# EAGLE design Hi-Hat2 (EAGLE 8.6.2)
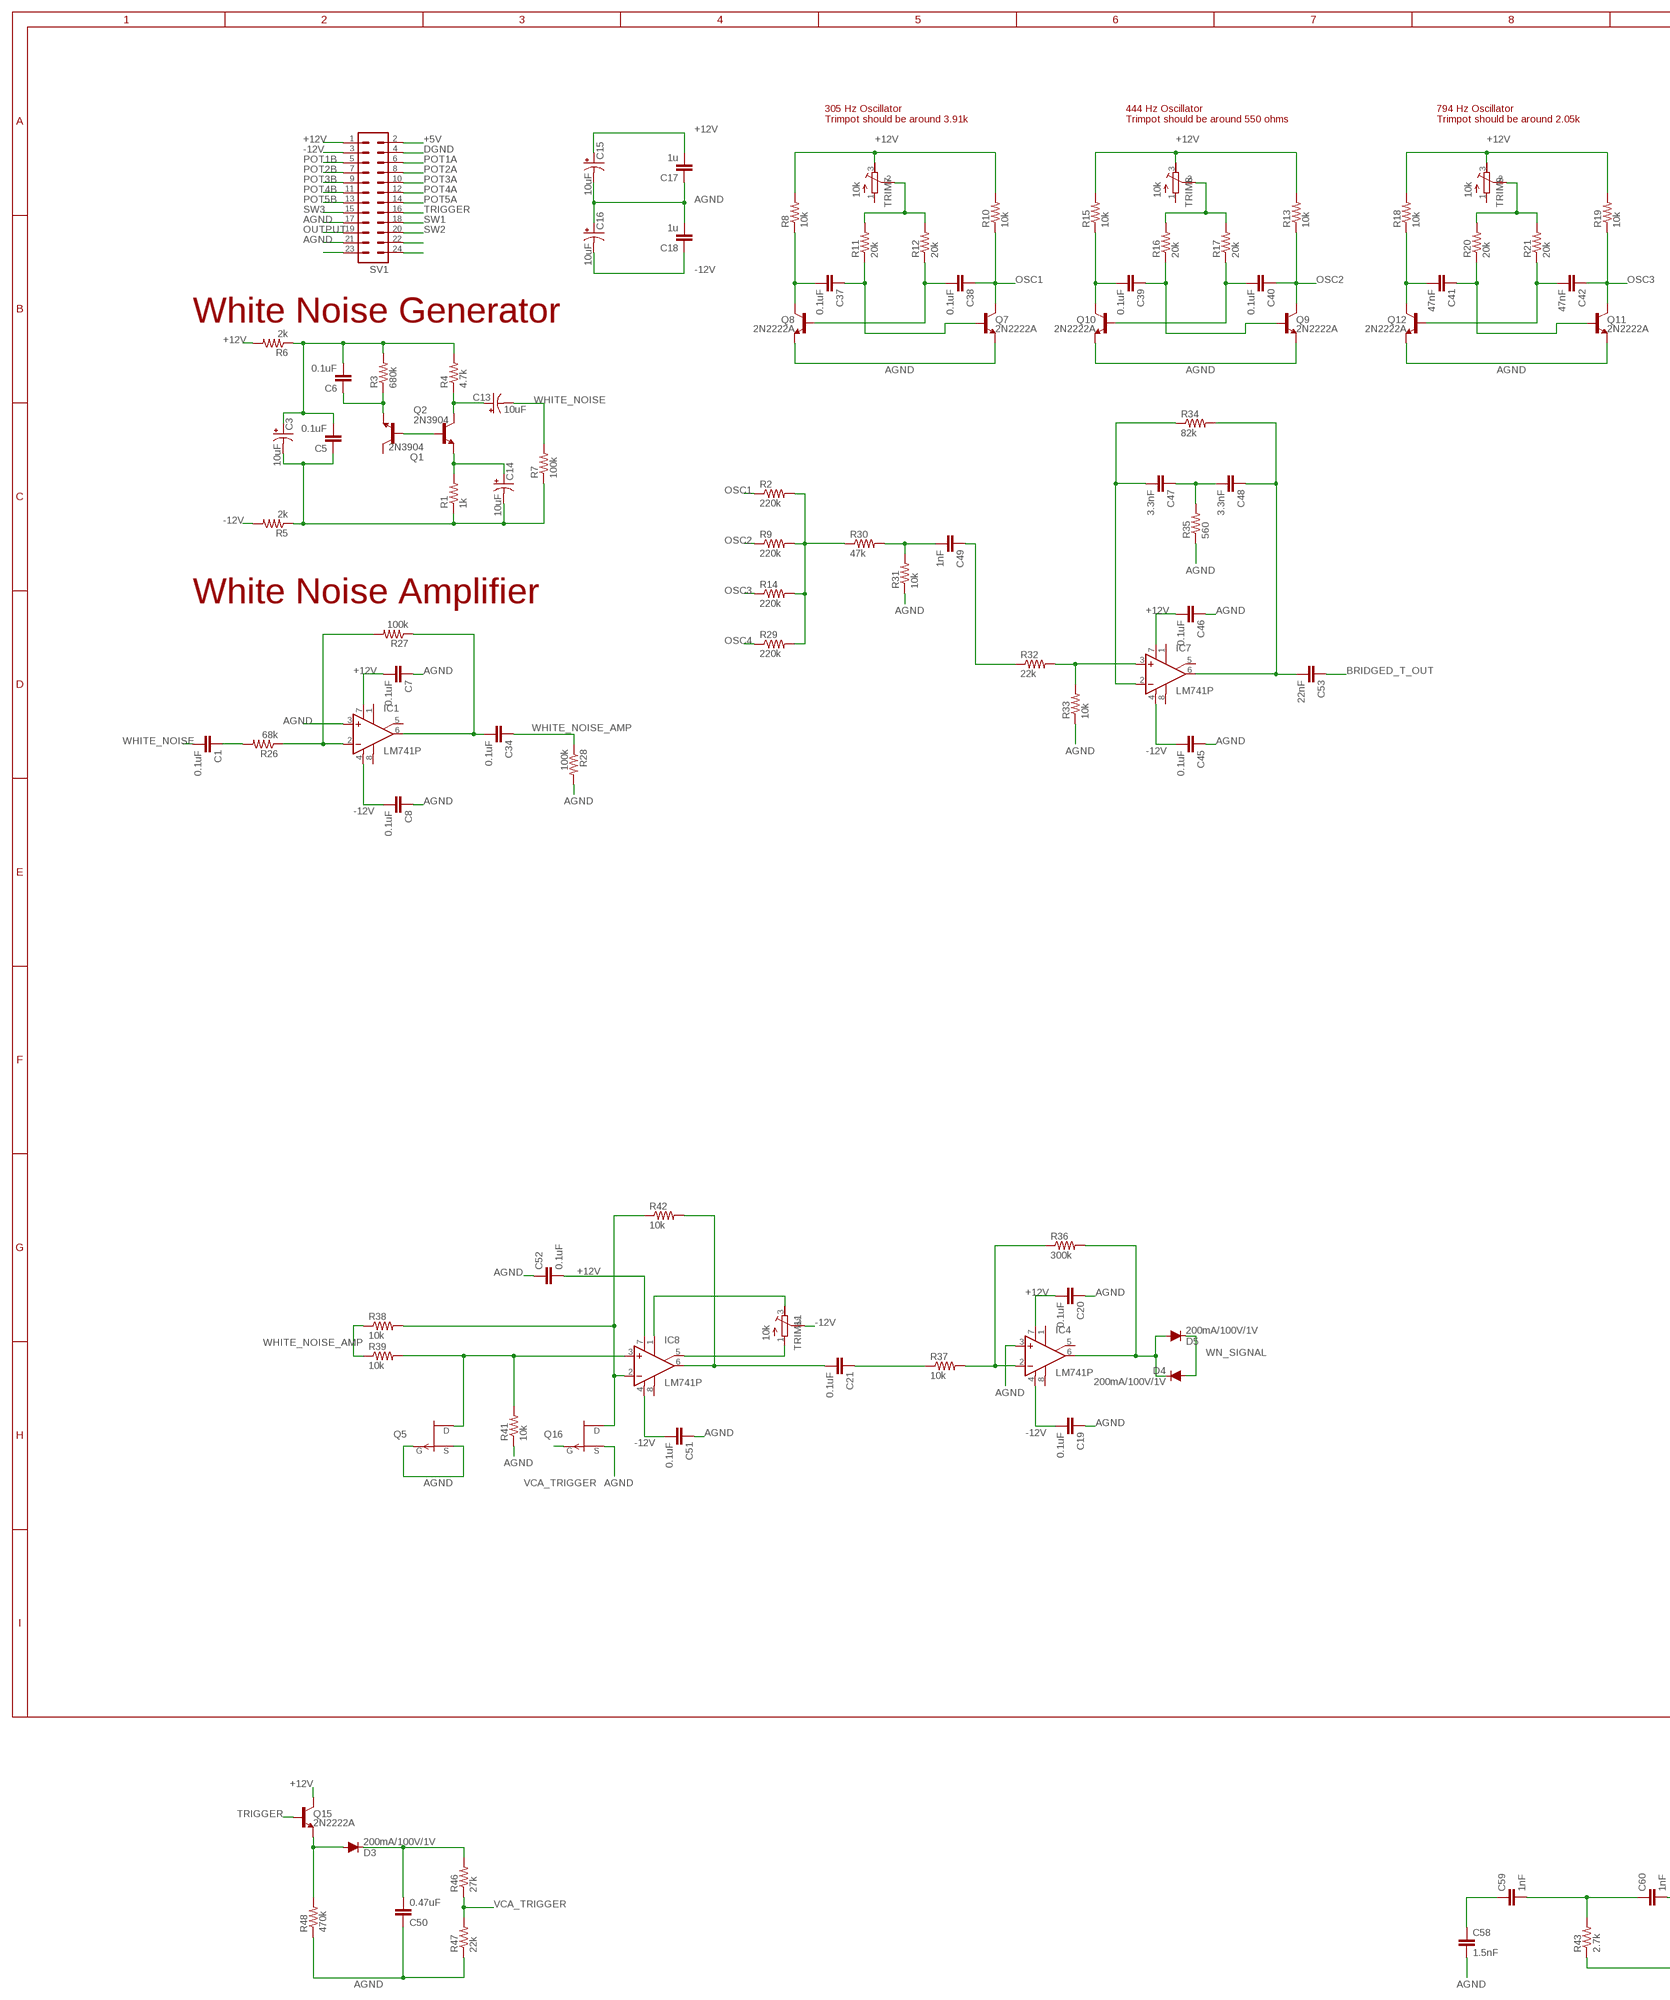
[diagram p0: schematic, sheet 1, part 1 of 2]
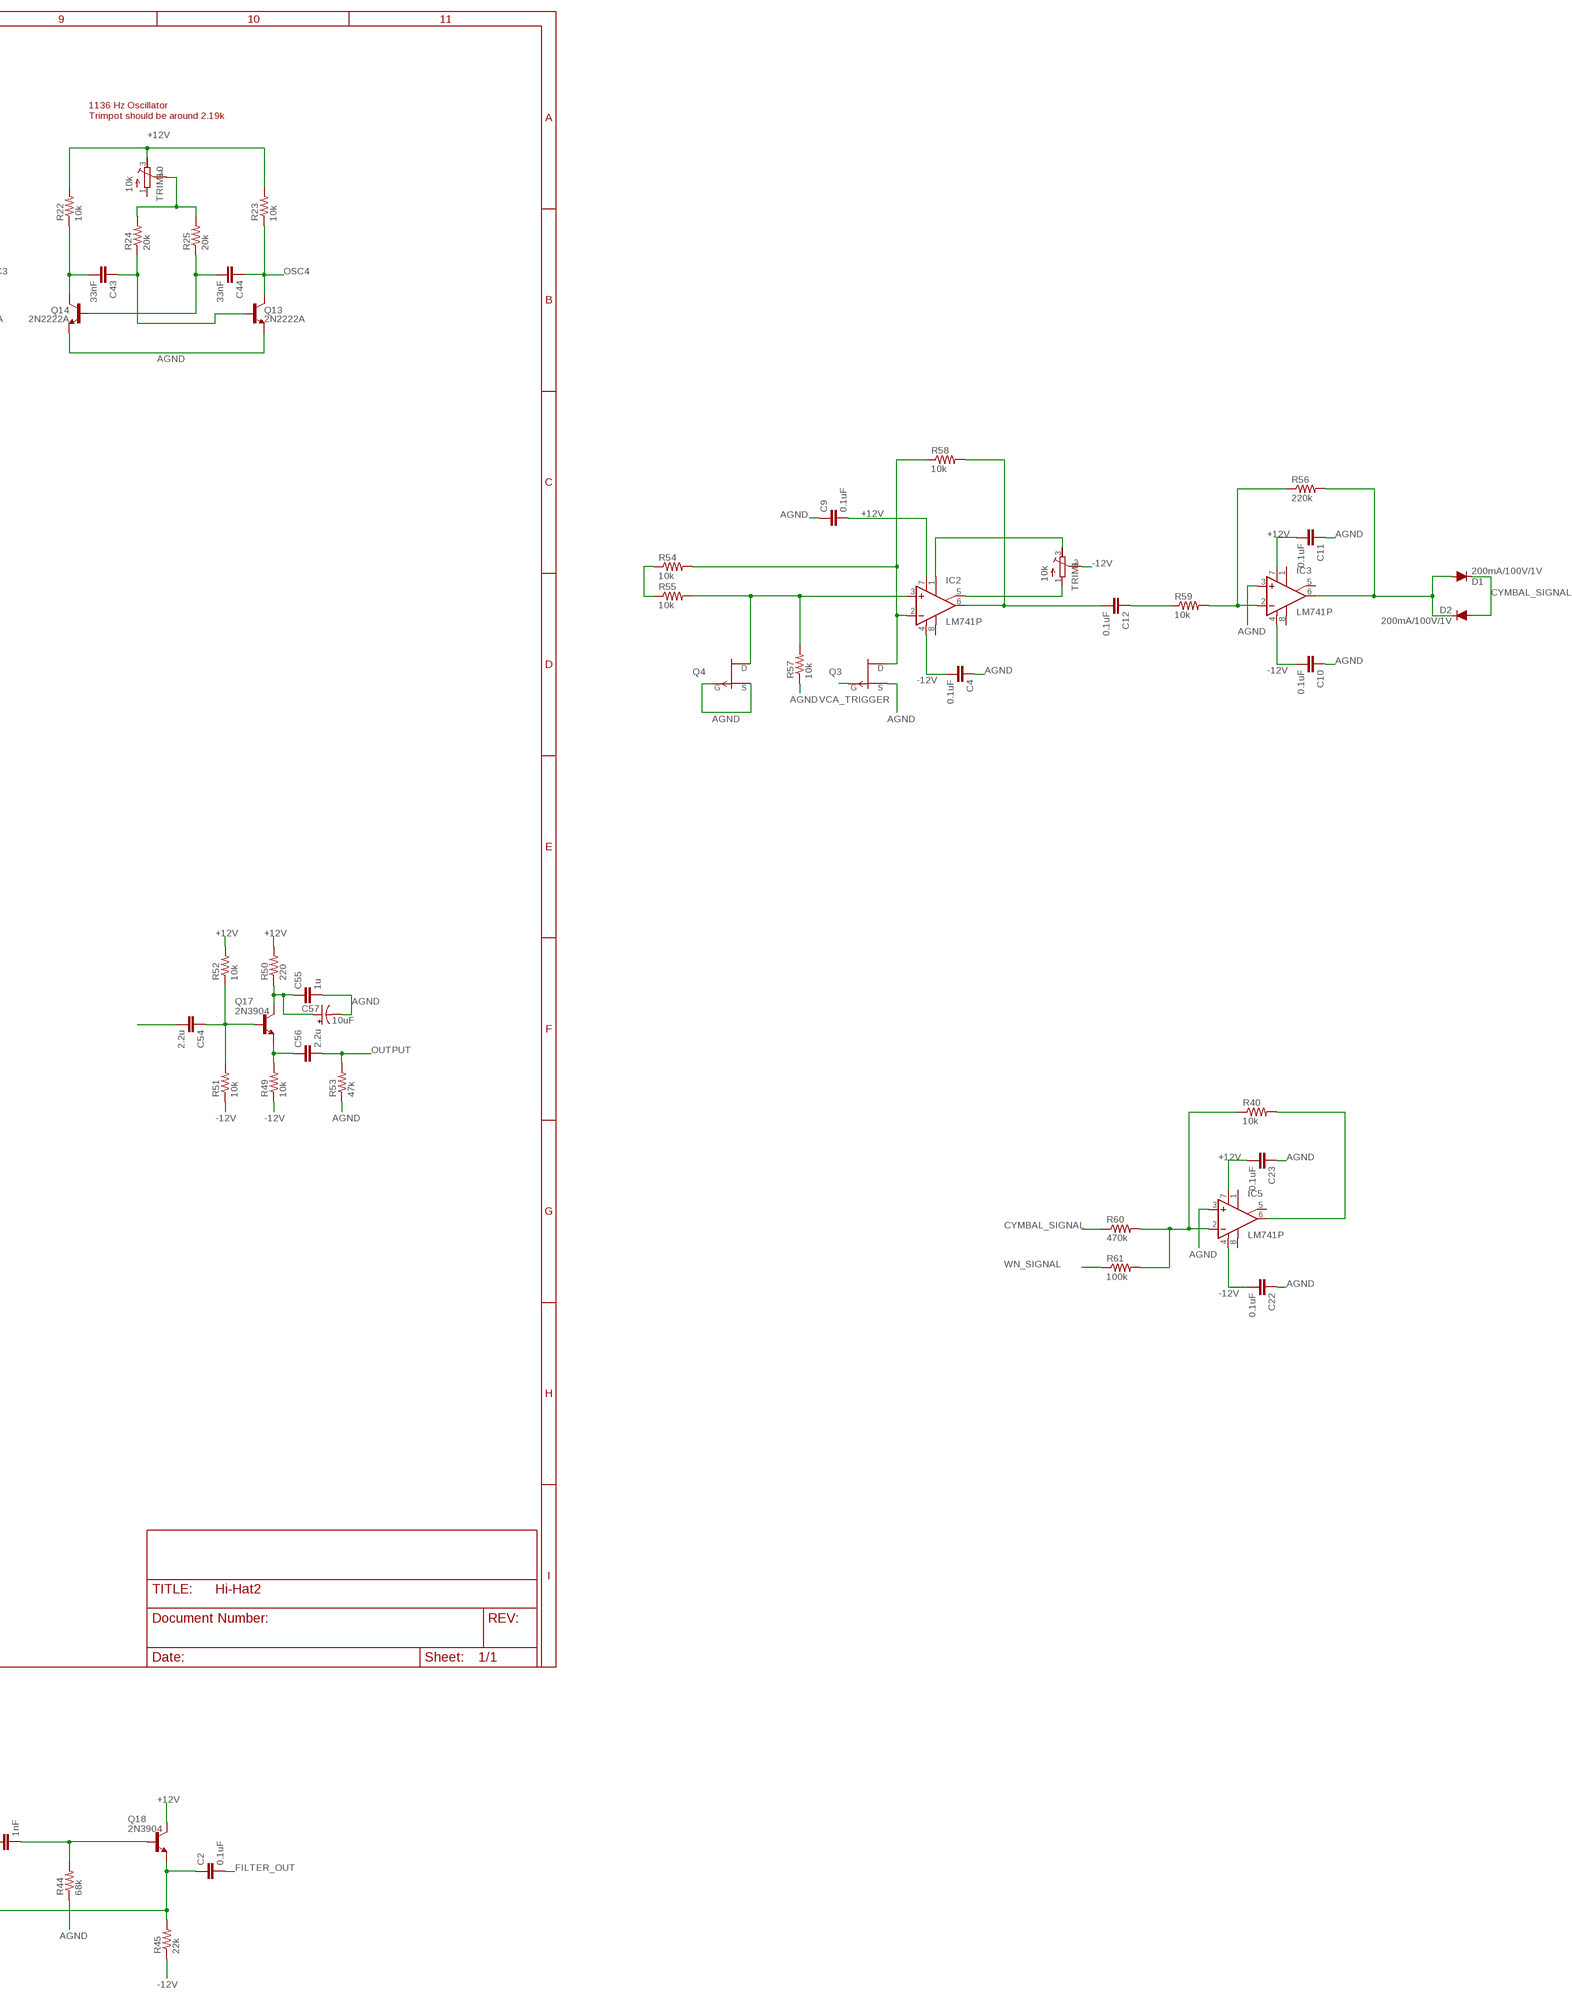
[diagram p1: schematic, sheet 1, part 2 of 2]

## Parts
C1  0.1uF  C-EU050-024X044  [C050-024X044]
C2  0.1uF  C-EU050-024X044  [C050-024X044]
C3  10uF  CPOL-USE2.5-6  [E2,5-6]
C4  0.1uF  C-EU050-024X044  [C050-024X044]
C5  0.1uF  C-EU050-024X044  [C050-024X044]
C6  0.1uF  C-EU050-024X044  [C050-024X044]
C7  0.1uF  C-EU050-024X044  [C050-024X044]
C8  0.1uF  C-EU050-024X044  [C050-024X044]
C9  0.1uF  C-EU050-024X044  [C050-024X044]
C10  0.1uF  C-EU050-024X044  [C050-024X044]
C11  0.1uF  C-EU050-024X044  [C050-024X044]
C12  0.1uF  C-EU050-024X044  [C050-024X044]
C13  10uF  CPOL-USE2.5-6  [E2,5-6]
C14  10uF  CPOL-USE2.5-6  [E2,5-6]
C15  10uF  CPOL-USE2.5-6  [E2,5-6]
C16  10uF  CPOL-USE2.5-6  [E2,5-6]
C17  1u  C-EU050-024X044  [C050-024X044]
C18  1u  C-EU050-024X044  [C050-024X044]
C19  0.1uF  C-EU050-024X044  [C050-024X044]
C20  0.1uF  C-EU050-024X044  [C050-024X044]
C21  0.1uF  C-EU050-024X044  [C050-024X044]
C22  0.1uF  C-EU050-024X044  [C050-024X044]
C23  0.1uF  C-EU050-024X044  [C050-024X044]
C34  0.1uF  C-EU050-024X044  [C050-024X044]
C37  0.1uF  C-EU050-024X044  [C050-024X044]
C38  0.1uF  C-EU050-024X044  [C050-024X044]
C39  0.1uF  C-EU050-024X044  [C050-024X044]
C40  0.1uF  C-EU050-024X044  [C050-024X044]
C41  47nF  C-EU050-024X044  [C050-024X044]
C42  47nF  C-EU050-024X044  [C050-024X044]
C43  33nF  C-EU050-024X044  [C050-024X044]
C44  33nF  C-EU050-024X044  [C050-024X044]
C45  0.1uF  C-EU050-024X044  [C050-024X044]
C46  0.1uF  C-EU050-024X044  [C050-024X044]
C47  3.3nF  C-EU050-024X044  [C050-024X044]
C48  3.3nF  C-EU050-024X044  [C050-024X044]
C49  1nF  C-EU050-024X044  [C050-024X044]
C50  0.47uF  C-EU050-024X044  [C050-024X044]
C51  0.1uF  C-EU050-024X044  [C050-024X044]
C52  0.1uF  C-EU050-024X044  [C050-024X044]
C53  22nF  C-EU050-024X044  [C050-024X044]
C54  2.2u  C-EU050-024X044  [C050-024X044]
C55  1u  C-EU050-024X044  [C050-024X044]
C56  2.2u  C-EU050-024X044  [C050-024X044]
C57  10uF  CPOL-USE2.5-6  [E2,5-6]
C58  1.5nF  C-EU050-024X044  [C050-024X044]
C59  1nF  C-EU050-024X044  [C050-024X044]
C60  1nF  C-EU050-024X044  [C050-024X044]
D1  200mA/100V/1V  DIODE-1N4148  [DIODE-1N4148]
D2  200mA/100V/1V  DIODE-1N4148  [DIODE-1N4148]
D3  200mA/100V/1V  DIODE-1N4148  [DIODE-1N4148]
D4  200mA/100V/1V  DIODE-1N4148  [DIODE-1N4148]
D5  200mA/100V/1V  DIODE-1N4148  [DIODE-1N4148]
IC1  LM741P  [DIL08]
IC2  LM741P  [DIL08]
IC3  LM741P  [DIL08]
IC4  LM741P  [DIL08]
IC5  LM741P  [DIL08]
IC7  LM741P  [DIL08]
IC8  LM741P  [DIL08]
Q1  2N3904  [TO92]
Q2  2N3904  [TO92]
Q3  J176  [TO-92]
Q4  J176  [TO-92]
Q5  J176  [TO-92]
Q7  2N2222A  TRANS_NPN-P2N2222A  [TO-92]
Q8  2N2222A  TRANS_NPN-P2N2222A  [TO-92]
Q9  2N2222A  TRANS_NPN-P2N2222A  [TO-92]
Q10  2N2222A  TRANS_NPN-P2N2222A  [TO-92]
Q11  2N2222A  TRANS_NPN-P2N2222A  [TO-92]
Q12  2N2222A  TRANS_NPN-P2N2222A  [TO-92]
Q13  2N2222A  TRANS_NPN-P2N2222A  [TO-92]
Q14  2N2222A  TRANS_NPN-P2N2222A  [TO-92]
Q15  2N2222A  TRANS_NPN-P2N2222A  [TO-92]
Q16  J176  [TO-92]
Q17  2N3904  [TO92]
Q18  2N3904  [TO92]
R1  1k  R-US_0207/7  [0207/7]
R2  220k  R-US_0207/7  [0207/7]
R3  680k  R-US_0207/7  [0207/7]
R4  4.7k  R-US_0207/7  [0207/7]
R5  2k  R-US_0207/7  [0207/7]
R6  2k  R-US_0207/7  [0207/7]
R7  100k  R-US_0207/7  [0207/7]
R8  10k  R-US_0207/7  [0207/7]
R9  220k  R-US_0207/7  [0207/7]
R10  10k  R-US_0207/7  [0207/7]
R11  20k  R-US_0207/7  [0207/7]
R12  20k  R-US_0207/7  [0207/7]
R13  10k  R-US_0207/7  [0207/7]
R14  220k  R-US_0207/7  [0207/7]
R15  10k  R-US_0207/7  [0207/7]
R16  20k  R-US_0207/7  [0207/7]
R17  20k  R-US_0207/7  [0207/7]
R18  10k  R-US_0207/7  [0207/7]
R19  10k  R-US_0207/7  [0207/7]
R20  20k  R-US_0207/7  [0207/7]
R21  20k  R-US_0207/7  [0207/7]
R22  10k  R-US_0207/7  [0207/7]
R23  10k  R-US_0207/7  [0207/7]
R24  20k  R-US_0207/7  [0207/7]
R25  20k  R-US_0207/7  [0207/7]
R26  68k  R-US_0207/7  [0207/7]
R27  100k  R-US_0207/7  [0207/7]
R28  100k  R-US_0207/7  [0207/7]
R29  220k  R-US_0207/7  [0207/7]
R30  47k  R-US_0207/7  [0207/7]
R31  10k  R-US_0207/7  [0207/7]
R32  22k  R-US_0207/7  [0207/7]
R33  10k  R-US_0207/7  [0207/7]
R34  82k  R-US_0207/7  [0207/7]
R35  560  R-US_0207/7  [0207/7]
R36  300k  R-US_0207/7  [0207/7]
R37  10k  R-US_0207/7  [0207/7]
R38  10k  R-US_0207/7  [0207/7]
R39  10k  R-US_0207/7  [0207/7]
R40  10k  R-US_0207/7  [0207/7]
R41  10k  R-US_0207/7  [0207/7]
R42  10k  R-US_0207/7  [0207/7]
R43  2.7k  R-US_0207/7  [0207/7]
R44  68k  R-US_0207/7  [0207/7]
R45  22k  R-US_0207/7  [0207/7]
R46  27k  R-US_0207/7  [0207/7]
R47  22k  R-US_0207/7  [0207/7]
R48  470k  R-US_0207/7  [0207/7]
R49  10k  R-US_0207/7  [0207/7]
R50  220  R-US_0207/7  [0207/7]
R51  10k  R-US_0207/7  [0207/7]
R52  10k  R-US_0207/7  [0207/7]
R53  47k  R-US_0207/7  [0207/7]
R54  10k  R-US_0207/7  [0207/7]
R55  10k  R-US_0207/7  [0207/7]
R56  220k  R-US_0207/7  [0207/7]
R57  10k  R-US_0207/7  [0207/7]
R58  10k  R-US_0207/7  [0207/7]
R59  10k  R-US_0207/7  [0207/7]
R60  470k  R-US_0207/7  [0207/7]
R61  100k  R-US_0207/7  [0207/7]
SV1  MA12-2  [MA12-2]
TRIM1  10k  R-TRIMM64W  [RTRIM64W]
TRIM7  10k  R-TRIMM64W  [RTRIM64W]
TRIM8  10k  R-TRIMM64W  [RTRIM64W]
TRIM9  10k  R-TRIMM64W  [RTRIM64W]
TRIM10  10k  R-TRIMM64W  [RTRIM64W]
TRIM11  10k  R-TRIMM64W  [RTRIM64W]

## Nets
+5V: SV1.2
+12V: C7.2 C9.2 C11.2 C15.+ C17.2 C20.2 C23.2 C46.2 C52.2 IC1.7(V+) IC2.7(V+) IC3.7(V+) IC4.7(V+) IC5.7(V+) IC7.7(V+) IC8.7(V+) Q15.1(C) Q18.1(C) R6.2 R8.2 R10.2 R13.2 R15.2 R18.2 R19.2 R22.2 R23.2 R50.2 R52.2 SV1.1 TRIM7.3(E) TRIM8.3(E) TRIM9.3(E) TRIM10.3(E)
-12V: C4.2 C8.2 C10.2 C16.- C18.1 C19.2 C22.2 C45.2 C51.2 IC1.4(V-) IC2.4(V-) IC3.4(V-) IC4.4(V-) IC5.4(V-) IC7.4(V-) IC8.4(V-) R5.2 R45.1 R49.1 R51.1 SV1.3 TRIM1.2(S) TRIM11.2(S)
AGND: C4.1 C7.1 C8.1 C9.1 C10.1 C11.1 C15.- C16.+ C17.1 C18.2 C19.1 C20.1 C22.1 C23.1 C45.1 C46.1 C50.1 C51.1 C52.1 C55.2 C57.- C58.2 IC1.3(+IN) IC3.3(+IN) IC4.3(+IN) IC5.3(+IN) Q3.3(S) Q4.2(G) Q4.3(S) Q5.2(G) Q5.3(S) Q7.3(E) Q8.3(E) Q9.3(E) Q10.3(E) Q11.3(E) Q12.3(E) Q13.3(E) Q14.3(E) Q16.3(S) R28.2 R31.1 R33.1 R35.1 R41.1 R44.1 R47.1 R48.1 R53.1 R57.1 SV1.17 SV1.21
BRIDGED_T_OUT: C53.1
CC_INPUT1: C54.2
CYMBAL_SIGNAL: D1.C D2.A R60.1
DGND: SV1.4
FILTER_OUT: C2.2
N$1: C50.2 D3.C R46.2
N$2: IC2.3(+IN) Q4.1(D) R55.2 R57.2
N$3: IC2.2(-IN) Q3.1(D) R54.2 R58.1
N$4: IC2.5(ON2) TRIM1.1(A)
N$5: C14.+ Q2.3(E) R1.2
N$6: C3.+ C5.2 C6.2 R3.2 R4.2 R6.1
N$7: IC2.1(ON1) TRIM1.3(E)
N$8: IC3.2(-IN) R56.1 R59.2
N$9: C34.2 IC1.6(OUT) R27.1
N$10: IC5.2(-IN) R40.1 R60.2 R61.2
N$11: C37.2 Q8.1(C) R8.1
N$12: C37.1 Q7.2(B) R11.1
N$13: C38.2 Q8.2(B) R12.1
N$14: C47.2 IC7.2(-IN) R34.1
N$15: R11.2 R12.2 TRIM7.2(S)
N$16: C39.2 Q10.1(C) R15.1
N$17: Q1.2(B) Q2.2(B)
N$18: C39.1 Q9.2(B) R16.1
N$19: C40.2 Q10.2(B) R17.1
N$20: C6.1 Q1.3(E) R3.1
N$21: C3.- C5.1 C14.- R1.1 R5.1 R7.1
N$22: R2.2 R9.2 R14.2 R29.2 R30.1
N$23: IC1.2(-IN) R26.1 R27.2
N$24: SV1.23
N$25: SV1.24
N$26: SV1.22
N$27: C12.1 R59.1
N$28: C1.1 R26.2
N$29: R16.2 R17.2 TRIM8.2(S)
N$30: C13.+ Q2.1(C) R4.1
N$31: C41.2 Q12.1(C) R18.1
N$32: IC4.2(-IN) R36.1 R37.2
N$34: C21.1 R37.1
N$35: C41.1 Q11.2(B) R20.1
N$36: C21.2 IC8.6(OUT) R42.2
N$37: IC5.6(OUT) R40.2
N$38: D4.C D5.A IC4.6(OUT) R36.2
N$39: D1.A D2.C IC3.6(OUT) R56.2
N$44: C42.2 Q12.2(B) R21.1
N$47: C47.1 C48.2 R35.2
N$54: R20.2 R21.2 TRIM9.2(S)
N$55: C43.2 Q14.1(C) R22.1
N$56: C43.1 Q13.2(B) R24.1
N$57: C44.2 Q14.2(B) R25.1
N$58: C49.2 R30.2 R31.2
N$59: R24.2 R25.2 TRIM10.2(S)
N$60: C48.1 C53.2 IC7.6(OUT) R34.2
N$61: IC7.3(+IN) R32.2 R33.2
N$62: C49.1 R32.1
N$63: C54.1 Q17.2(B) R51.2 R52.1
N$64: D3.A Q15.3(E) R48.2
N$65: IC8.3(+IN) Q5.1(D) R39.2 R41.2
N$66: IC8.2(-IN) Q16.1(D) R38.2 R42.1
N$67: IC8.5(ON2) TRIM11.1(A)
N$68: IC8.1(ON1) TRIM11.3(E)
N$71: C56.1 Q17.3(E) R49.2
N$72: C55.1 C57.+ Q17.1(C) R50.1
N$73: C59.2 C60.1 R43.2
N$74: C60.2 Q18.2(B) R44.2
N$75: C2.1 Q18.3(E) R43.1 R45.2
OSC1: C38.1 Q7.1(C) R2.1 R10.1
OSC2: C40.1 Q9.1(C) R9.1 R13.1
OSC3: C42.1 Q11.1(C) R14.1 R19.1
OSC4: C44.1 Q13.1(C) R23.1 R29.1
OUTPUT: C56.2 R53.2 SV1.19
POT1A: SV1.6
POT1B: SV1.5
POT2A: SV1.8
POT2B: SV1.7
POT3A: SV1.10
POT3B: SV1.9
POT4A: SV1.12
POT4B: SV1.11
POT5A: SV1.14
POT5B: SV1.13
SW1: C58.1 C59.1 SV1.18
SW2: SV1.20
SW3: SV1.15
SW4: C12.2 IC2.6(OUT) R58.2
TRIGGER: Q15.2(B) SV1.16
VCA_INPUT1: R54.1 R55.1
VCA_TRIGGER: Q3.2(G) Q16.2(G) R46.1 R47.2
WHITE_NOISE: C1.2 C13.- R7.2
WHITE_NOISE_AMP: C34.1 R28.1 R38.1 R39.1
WN_SIGNAL: D4.A D5.C R61.1
Unconnected: IC1.1(ON1) IC1.5(ON2) IC1.8(OPT) IC2.8(OPT) IC3.1(ON1) IC3.5(ON2) IC3.8(OPT) IC4.1(ON1) IC4.5(ON2) IC4.8(OPT) IC5.1(ON1) IC5.5(ON2) IC5.8(OPT) IC7.1(ON1) IC7.5(ON2) IC7.8(OPT) IC8.8(OPT) Q1.1(C) TRIM7.1(A) TRIM8.1(A) TRIM9.1(A) TRIM10.1(A)

## Notes on the sheet
- 305 Hz Oscillator
  Trimpot should be around 3.91k
- 444 Hz Oscillator
  Trimpot should be around 550 ohms
- 794 Hz Oscillator
  Trimpot should be around 2.05k
- 1136 Hz Oscillator
  Trimpot should be around 2.19k
- White Noise Generator
- White Noise Amplifier

## Library data of the parts
C1 C2 C4-C12 C17-C23 C34 C37-C56 C58-C60 = resistor:C-EU: CAPACITOR, European symbol
C3 C13-C16 C57 = rcl:CPOL-US: POLARIZED CAPACITOR, American symbol; SPICEPREFIX: C
D1-D5 = SparkFun-DiscreteSemi:DIODE: Diode These are standard reverse protection diodes and small signal diodes. SparkFun Products: SparkFun SparkPunk Sound Kit <https://www.sparkfun.com/products/11177> SparkFun ESP8266 Thing <https://www.sparkfun.com/products/13231>; PROD_ID: DIO-08378
IC1-IC5 IC7 IC8 = linear:*741: OP AMP
Q1 Q2 Q17 Q18 = transistor:2N3904: NPN TRANSISTOR
Q3-Q5 Q16 = Capstone:J176
Q7-Q15 = SparkFun-DiscreteSemi:TRANS_NPN: NPN transistor Current controlled devices typically used to amplify current or used as a switch. BC547 - COM-08928 <http://www.sparkfun.com/products/8928> (TO-92 45V 100mA) (1.Collector 2.Base 3.Emitter) 2N3904 - COM-00521 <http://www.sparkfun.com/products/521> (TO-92 40V 200mA) (1.Emitter 2.Base 3.Collector) P2N2222A - COM-12852 <http://www.sparkfun.com/products/12852> (TO-92 40V 600mA) (1.Collector 2.Base 3.Emitter); PROD_ID: TRANS-09536; VALUE: 600mA/40V
R1-R61 = rcl:R-US_: RESISTOR, American symbol; SPICEPREFIX: R
SV1 = con-lstb:MA12-2: PIN HEADER; OC_FARNELL: unknown; OC_NEWARK: unknown
TRIM1 TRIM7-TRIM11 = rcl:R-TRIMM: Trimm resistor; SPICEMODEL: X; SPICEPREFIXL: POT

## Board
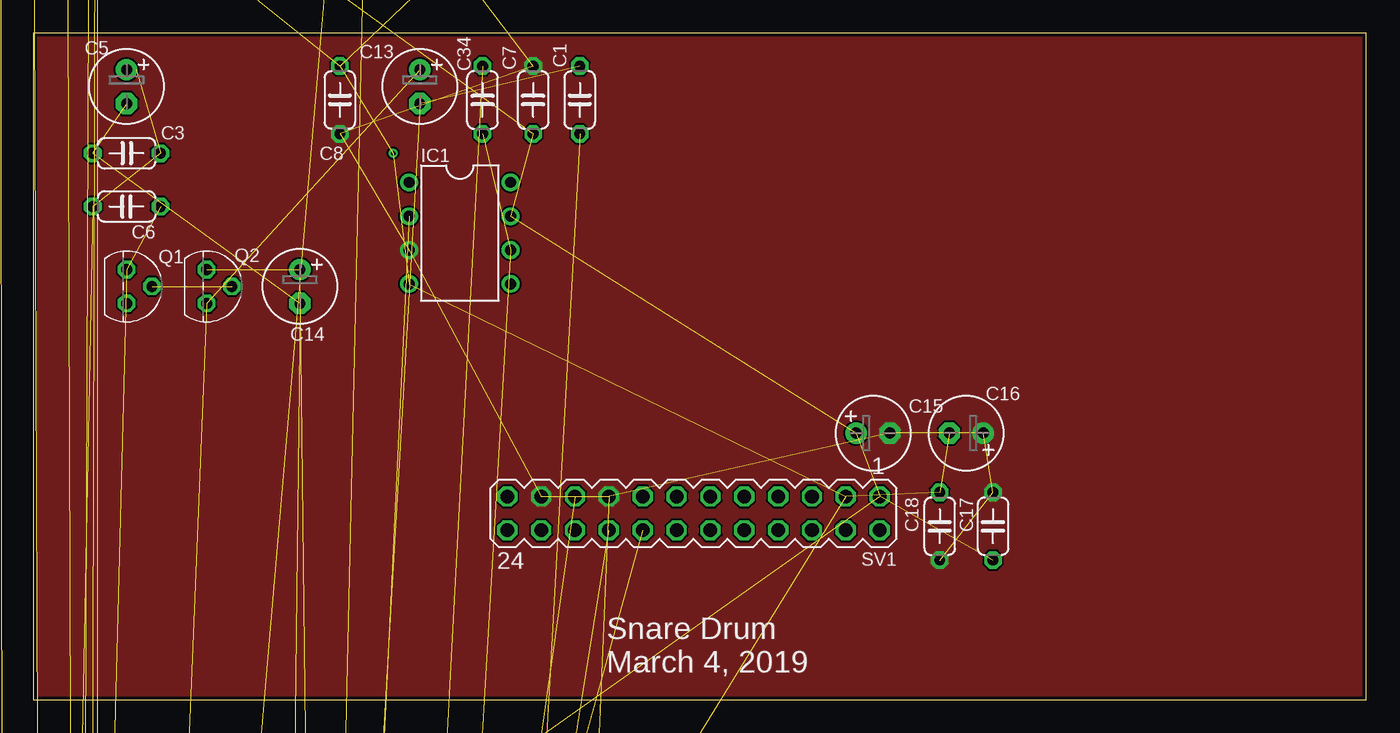
[diagram p2: board, top side]
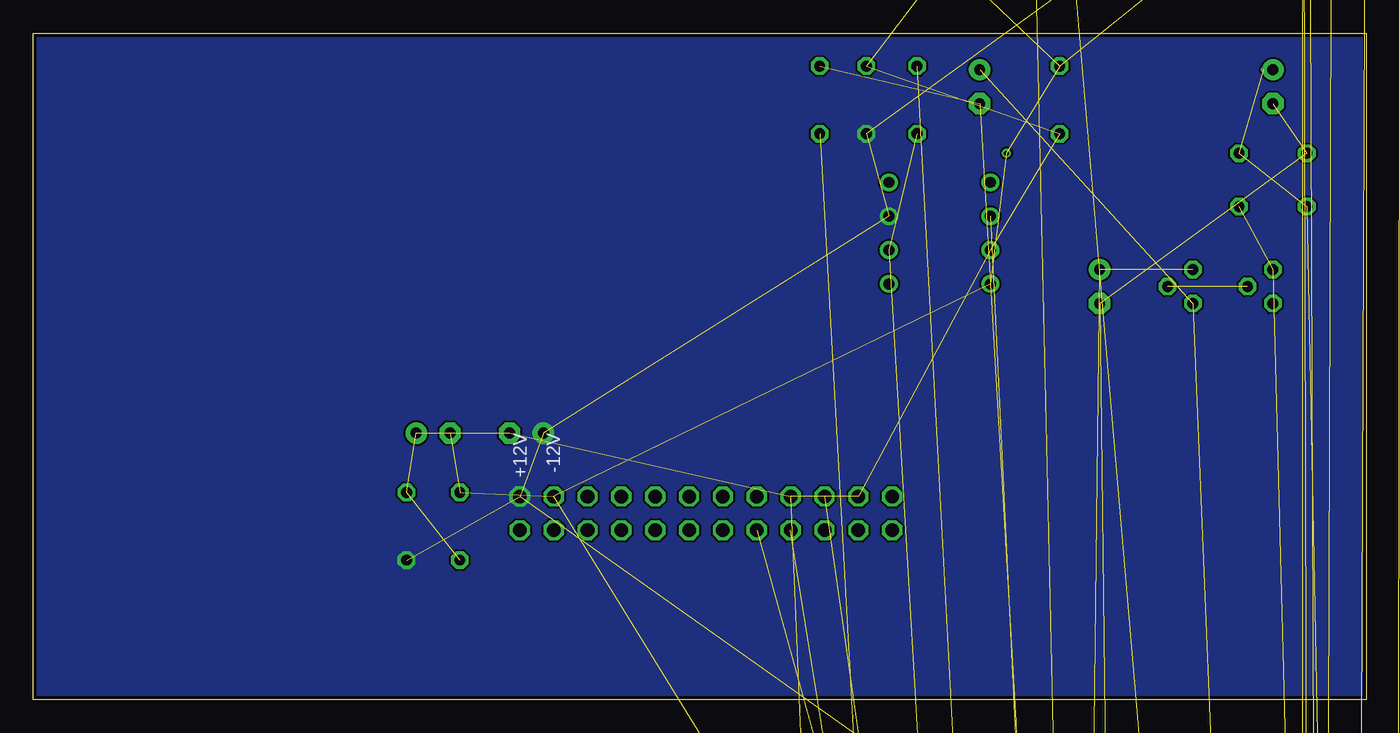
[diagram p3: board, bottom side, seen from below]

Size 100 x 50 mm. Coordinates in mm from the lower left corner, seen from the top.
Outline: 0,0 100,0 100,50 0,50 0,0
Copper layers (1*16): Top 0.035mm / dielectric 1.5mm / Bottom 0.035mm
Design rules "SeeedStudio_2layer_DRU_no_angle_20140221": minimum track width 6mil, minimum drill 12mil, track to track 6mil, track to pad 6mil, pad to pad 6mil, via to via 6mil, smd to smd 0mil, copper to edge 10mil, drill to drill 10mil, minimum pad ring 10mil, minimum via ring 6mil, stop-mask expansion 2mil, vias tented up to drill 100mil, thermal gap 10mil

### Footprints (pad centres in the part's own frame; a part is rotated, then mirrored left to right if it is on the bottom)
C050-024X044 = drill 0.813 octagon: 1 -2.54,0; 2 2.54,0
E2,5-6 = drill 0.813 pad 1.6: + -1.27,0 | drill 0.813 pad 1.6 octagon: - 1.27,0
DIODE-1N4148 = drill 0.9 pad 1.88: A -3.81,0; C 3.81,0
DIL08 = drill 0.813 pad 1.27: 1 -3.81,-3.81; 2 -1.27,-3.81; 3 1.27,-3.81; 4 3.81,-3.81; 5 3.81,3.81; 6 1.27,3.81; 7 -1.27,3.81; 8 -3.81,3.81
TO92 = drill 0.813 octagon: 1 1.27,0; 2 0,1.905; 3 -1.27,0
TO-92 = drill 0.813 pad 1.88: 1 -1.27,0; 2 0,1.905; 3 1.27,0
0207/7 = drill 0.813 octagon: 1 -3.81,0; 2 3.81,0
MA12-2 = drill 1.016 octagon: 1 -13.97,-1.27; 2 -13.97,1.27; 3 -11.43,-1.27; 4 -11.43,1.27; 5 -8.89,-1.27; 6 -8.89,1.27; 7 -6.35,-1.27; 8 -6.35,1.27; 9 -3.81,-1.27; 10 -3.81,1.27; 11 -1.27,-1.27; 12 -1.27,1.27; 13 1.27,-1.27; 14 1.27,1.27; 15 3.81,-1.27; 16 3.81,1.27; 17 6.35,-1.27; 18 6.35,1.27; 19 8.89,-1.27; 20 8.89,1.27; 21 11.43,-1.27; 22 11.43,1.27; 23 13.97,-1.27; 24 13.97,1.27
RTRIM64W = drill 0.61: 1 1.27,-2.54; 2 1.27,0; 3 1.27,2.54

### Placement (x,y rotation side)
C1  41,45 90 top
C2  0,-301 0 top  (outside the outline)
C3  7,46 270 top
C4  21,114 0 top  (outside the outline)
C5  7,41 0 top
C6  7,37 180 top
C7  37.5,45 270 top
C8  23,45 90 top
C9  -1,128 0 top  (outside the outline)
C10  -1,164 0 top  (outside the outline)
C11  -1,178 0 top  (outside the outline)
C12  -1,-1092 0 top  (outside the outline)
C13  29,46 270 top
C14  20,31 270 top
C15  63,20 0 top
C16  70,20 180 top
C17  72,13 270 top
C18  68,13 270 top
C19  -1,242 0 top  (outside the outline)
C20  18,242 0 top  (outside the outline)
C21  -1,-1127 0 top  (outside the outline)
C22  -1,306 0 top  (outside the outline)
C23  18,306 0 top  (outside the outline)
C34  33.7,45 270 top
C37  2,-24 0 top  (outside the outline)
C38  9,-24 0 top  (outside the outline)
C39  16,-24 0 top  (outside the outline)
C40  23,-24 0 top  (outside the outline)
C41  30,-24 0 top  (outside the outline)
C42  37,-24 0 top  (outside the outline)
C43  2,-31 0 top  (outside the outline)
C44  9,-31 0 top  (outside the outline)
C45  2,-72 0 top  (outside the outline)
C46  9,-72 0 top  (outside the outline)
C47  2,-84 0 top  (outside the outline)
C48  2,-91 0 top  (outside the outline)
C49  2,-133 0 top  (outside the outline)
C50  8,-150 0 top  (outside the outline)
C51  15,-183 0 top  (outside the outline)
C52  22,-183 0 top  (outside the outline)
C53  2,-209 0 top  (outside the outline)
C54  12,-231 0 top  (outside the outline)
C55  19,-231 0 top  (outside the outline)
C56  2,-238 0 top  (outside the outline)
C57  1,-231 0 top  (outside the outline)
C58  2,-260 0 top  (outside the outline)
C59  2,-267 0 top  (outside the outline)
C60  2,-279 0 top  (outside the outline)
D1  3,-1144 0 top  (outside the outline)
D2  3,-1163 0 top  (outside the outline)
D3  3,-167 0 top  (outside the outline)
D4  3,-1182 0 top  (outside the outline)
D5  3,-1201 0 top  (outside the outline)
IC1  32,35 270 top
IC2  1,66 0 top  (outside the outline)
IC3  1,146 0 top  (outside the outline)
IC4  1,196 0 top  (outside the outline)
IC5  1,260 0 top  (outside the outline)
IC7  6,-64 0 top  (outside the outline)
IC8  6,-184 0 top  (outside the outline)
Q1  7,31 270 top
Q2  13,31 270 top
Q3  23,65 0 top  (outside the outline)
Q4  1,-1047 0 top  (outside the outline)
Q5  1,-1110 0 top  (outside the outline)
Q7  41,-7 0 top  (outside the outline)
Q8  1,-18 0 top  (outside the outline)
Q9  7,-18 0 top  (outside the outline)
Q10  13,-18 0 top  (outside the outline)
Q11  19,-18 0 top  (outside the outline)
Q12  25,-18 0 top  (outside the outline)
Q13  31,-18 0 top  (outside the outline)
Q14  37,-18 0 top  (outside the outline)
Q15  1,-151 0 top  (outside the outline)
Q16  1,-193 0 top  (outside the outline)
Q17  1,-254 0 top  (outside the outline)
Q18  1,-290 0 top  (outside the outline)
R1  20,-286 0 top  (outside the outline)
R2  1,-651 0 top  (outside the outline)
R3  1,-343 0 top  (outside the outline)
R4  1,-357 0 top  (outside the outline)
R5  1,-315 0 top  (outside the outline)
R6  1,-329 0 top  (outside the outline)
R7  1,-371 0 top  (outside the outline)
R8  1,-385 0 top  (outside the outline)
R9  1,-665 0 top  (outside the outline)
R10  1,-399 0 top  (outside the outline)
R11  1,-413 0 top  (outside the outline)
R12  1,-427 0 top  (outside the outline)
R13  1,-441 0 top  (outside the outline)
R14  1,-679 0 top  (outside the outline)
R15  1,-455 0 top  (outside the outline)
R16  1,-469 0 top  (outside the outline)
R17  1,-483 0 top  (outside the outline)
R18  1,-497 0 top  (outside the outline)
R19  1,-511 0 top  (outside the outline)
R20  1,-525 0 top  (outside the outline)
R21  1,-539 0 top  (outside the outline)
R22  1,-553 0 top  (outside the outline)
R23  1,-567 0 top  (outside the outline)
R24  1,-581 0 top  (outside the outline)
R25  1,-595 0 top  (outside the outline)
R26  1,-609 0 top  (outside the outline)
R27  1,-623 0 top  (outside the outline)
R28  1,-637 0 top  (outside the outline)
R29  1,-693 0 top  (outside the outline)
R30  1,-707 0 top  (outside the outline)
R31  1,-721 0 top  (outside the outline)
R32  1,-735 0 top  (outside the outline)
R33  1,-749 0 top  (outside the outline)
R34  1,-763 0 top  (outside the outline)
R35  1,-777 0 top  (outside the outline)
R36  1,214 0 top  (outside the outline)
R37  1,228 0 top  (outside the outline)
R38  1,-819 0 top  (outside the outline)
R39  1,-833 0 top  (outside the outline)
R40  1,278 0 top  (outside the outline)
R41  1,-861 0 top  (outside the outline)
R42  1,-875 0 top  (outside the outline)
R43  1,-889 0 top  (outside the outline)
R44  1,-903 0 top  (outside the outline)
R45  1,-917 0 top  (outside the outline)
R46  1,-931 0 top  (outside the outline)
R47  1,-945 0 top  (outside the outline)
R48  1,-959 0 top  (outside the outline)
R49  1,-973 0 top  (outside the outline)
R50  1,-987 0 top  (outside the outline)
R51  1,-1001 0 top  (outside the outline)
R52  1,-1015 0 top  (outside the outline)
R53  1,-1029 0 top  (outside the outline)
R54  13,84 0 top  (outside the outline)
R55  34,84 0 top  (outside the outline)
R56  1,-1064 0 top  (outside the outline)
R57  22,100 0 top  (outside the outline)
R58  1,114 0 top  (outside the outline)
R59  1,-1078 0 top  (outside the outline)
R60  1,292 0 top  (outside the outline)
R61  1,-1218 0 top  (outside the outline)
SV1  49.53,13.97 180 top
TRIM1  39,64 0 top  (outside the outline)
TRIM7  3,-8 0 top  (outside the outline)
TRIM8  13,-8 0 top  (outside the outline)
TRIM9  23,-8 0 top  (outside the outline)
TRIM10  33,-8 0 top  (outside the outline)
TRIM11  3,-174 0 top  (outside the outline)

### Tracks (layer width: path | path; a pad name or v marks a point on that pad's centre or on a via)
+12V  (33 unrouted)
  pour Bottom (no thermals): -2,52 102,52 102,-2 -2,-2
-12V  (via drill 0.35)  (23 unrouted)
  other vias: 27,41
AGND  (51 unrouted)
  pour Top (no thermals): -1,51 -1,-1 101,-1 101,51
CYMBAL_SIGNAL  (2 unrouted)
N$1  (2 unrouted)
N$2  (3 unrouted)
N$3  (3 unrouted)
N$4  (1 unrouted)
N$5  (2 unrouted)
N$6  (5 unrouted)
  Bottom 0.406: 7.73,47.27 C3.+
N$7  (1 unrouted)
N$8  (2 unrouted)
N$9  (2 unrouted)
N$10  (3 unrouted)
N$11  (2 unrouted)
N$12  (2 unrouted)
N$13  (2 unrouted)
N$14  (2 unrouted)
N$15  (2 unrouted)
N$16  (2 unrouted)
N$17  (1 unrouted)
N$18  (2 unrouted)
N$19  (2 unrouted)
N$20  (2 unrouted)
N$21  (5 unrouted)
N$22  (4 unrouted)
N$23  (2 unrouted)
N$27  (1 unrouted)
N$28  (1 unrouted)
N$29  (2 unrouted)
N$30  (2 unrouted)
N$31  (2 unrouted)
N$32  (2 unrouted)
N$34  (1 unrouted)
N$35  (2 unrouted)
N$36  (2 unrouted)
N$37  (1 unrouted)
N$38  (3 unrouted)
N$39  (3 unrouted)
N$44  (2 unrouted)
N$47  (2 unrouted)
N$54  (2 unrouted)
N$55  (2 unrouted)
N$56  (2 unrouted)
N$57  (2 unrouted)
N$58  (2 unrouted)
N$59  (2 unrouted)
N$60  (3 unrouted)
N$61  (2 unrouted)
N$62  (1 unrouted)
N$63  (3 unrouted)
N$64  (2 unrouted)
N$65  (3 unrouted)
N$66  (3 unrouted)
N$67  (1 unrouted)
N$68  (1 unrouted)
N$71  (2 unrouted)
N$72  (3 unrouted)
N$73  (2 unrouted)
N$74  (2 unrouted)
N$75  (3 unrouted)
OSC1  (3 unrouted)
OSC2  (3 unrouted)
OSC3  (3 unrouted)
OSC4  (3 unrouted)
OUTPUT  (2 unrouted)
POT1A
  Bottom 0.406: 58.5,12.62 SV1.6
SW1  (2 unrouted)
SW4  (2 unrouted)
TRIGGER  (1 unrouted)
VCA_INPUT1  (1 unrouted)
VCA_TRIGGER  (3 unrouted)
WHITE_NOISE  (2 unrouted)
WHITE_NOISE_AMP  (3 unrouted)
WN_SIGNAL  (2 unrouted)

### Text on the board
tPlace: Snare Drum / March 4, 2019
bNames: -12V | +12V